# EAGLE design Arduino MEGA shield (EAGLE 7.1.0)
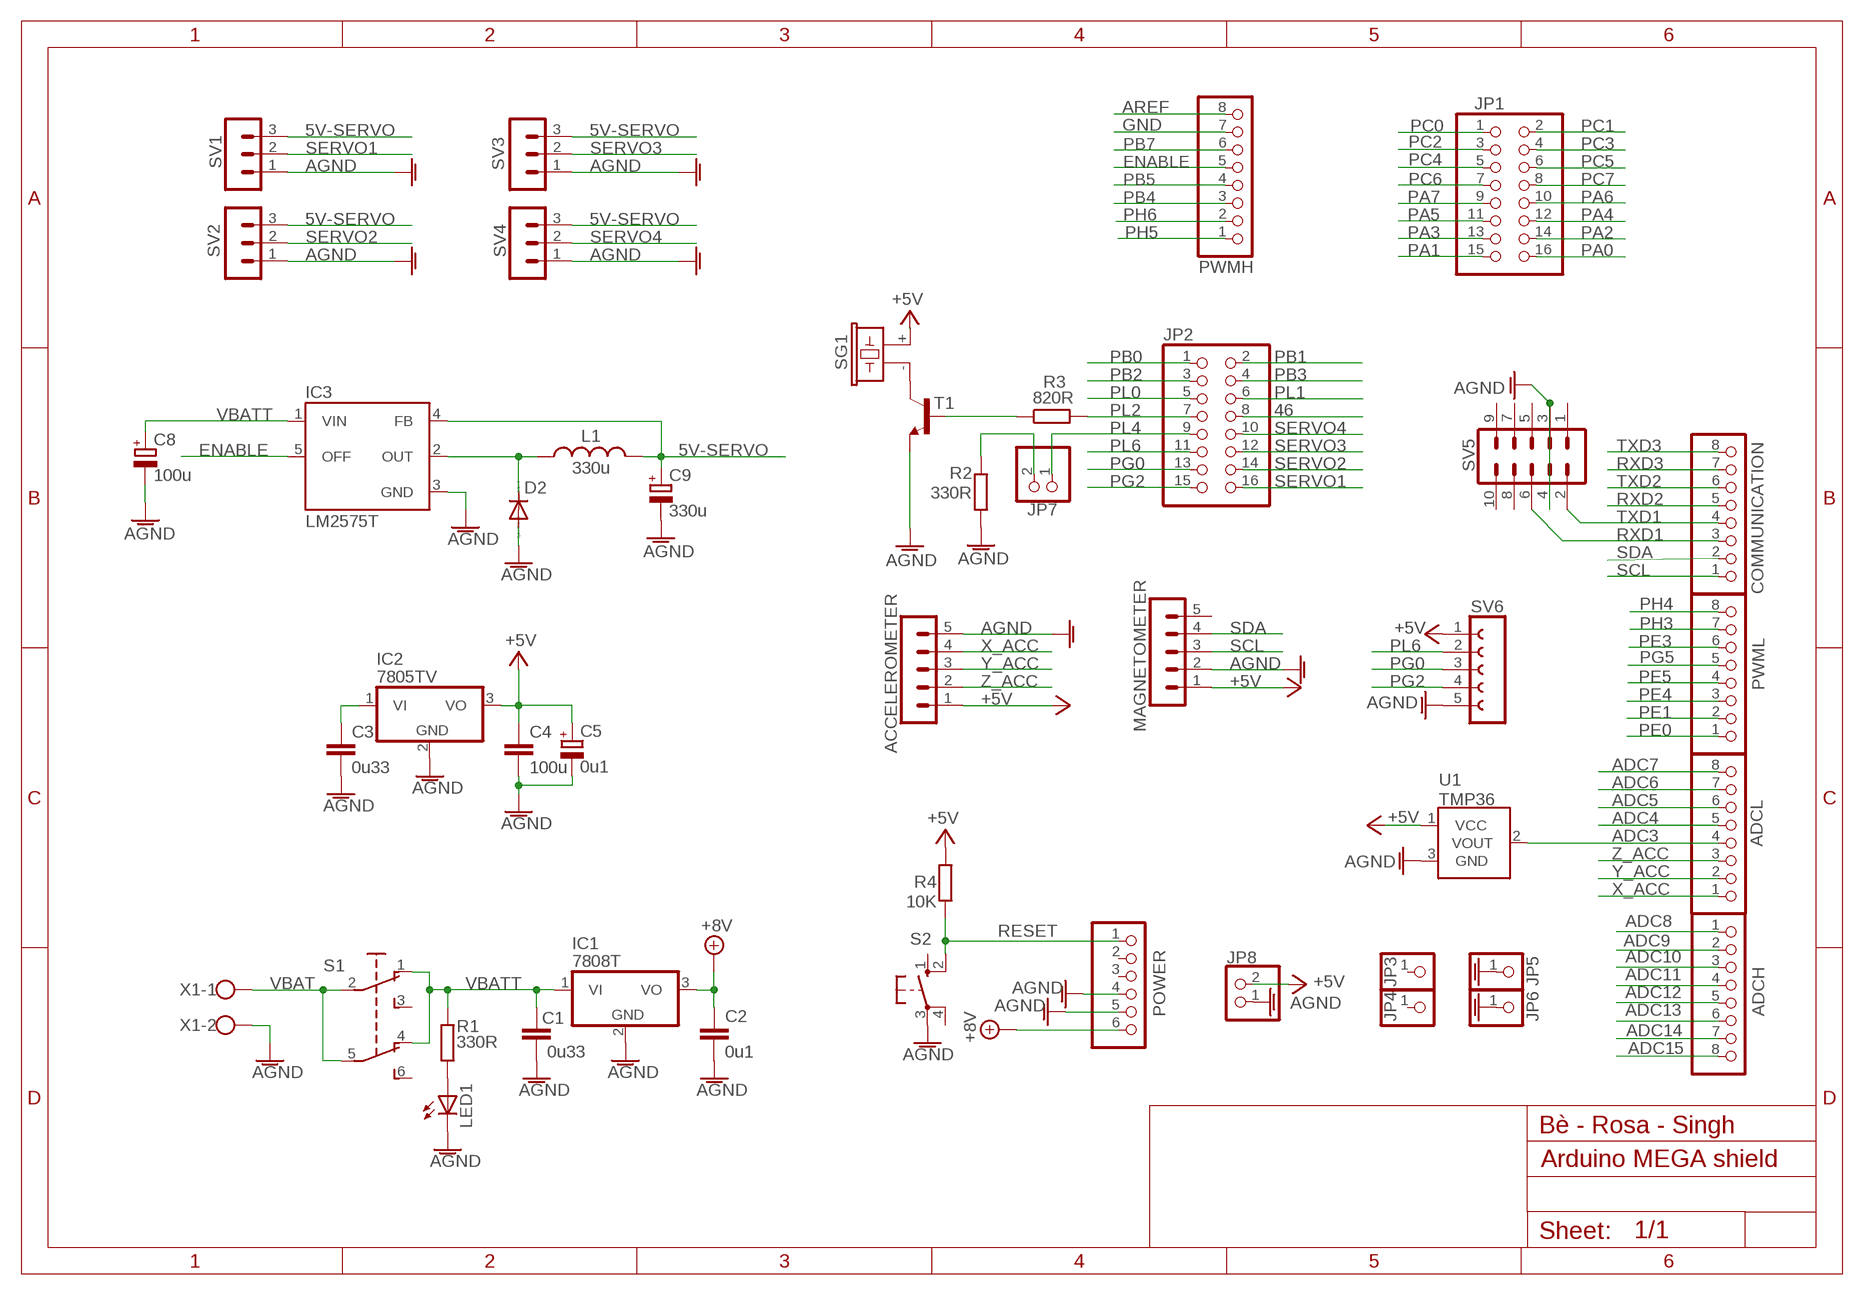
[diagram p0: schematic, sheet 1]

## Parts
ACCELEROMETER  MA05-1  [MA05-1]
ADCH  PINHD-1X8  [1X08]
ADCL  PINHD-1X8  [1X08]
C1  0u33  C-EU050-035X075  [C050-035X075]
C2  0u1  C-EU050-035X075  [C050-035X075]
C3  0u33  C-EU050-035X075  [C050-035X075]
C4  100u  C-EU050-035X075  [C050-035X075]
C5  0u1  CPOL-EUE2.5-7  [E2,5-7]
C8  100u  CPOL-EUE3.5-8  [E3,5-8]
C9  330u  CPOL-EUE3.5-8  [E3,5-8]
COMMUNICATION  PINHD-1X8  [1X08]
D2  1N5819  BA221  [DO35-10]
IC1  7808T  [TO220H]
IC2  7805TV  [TO220V]
IC3  LM2575T  [TO220-5]
JP1  PINHD-2X8  [2X08]
JP2  PINHD-2X8  [2X08]
JP3  PINHD-1X1  [1X01]
JP4  PINHD-1X1  [1X01]
JP5  PINHD-1X1  [1X01]
JP6  PINHD-1X1  [1X01]
JP7  PINHD-1X2  [1X02]
JP8  PINHD-1X2  [1X02]
L1  330u  INDUCTORAXIAL-0.6  [AXIAL-0.6]
LED1  LED5MM  [LED5MM]
MAGNETOMETER  MA05-1  [MA05-1]
POWER  PINHD-1X6  [1X06]
PWMH  PINHD-1X8  [1X08]
PWML  PINHD-1X8  [1X08]
R1  330R  R-EU_0207/10  [0207/10]
R2  330R  R-EU_0207/10  [0207/10]
R3  820R  R-EU_0207/10  [0207/10]
R4  10K  R-EU_0207/10  [0207/10]
S1  TL46PO  [TL4XPO]
S2  10-XX  [B3F-10XX]
SG1  F/CM12P  [F/CM12P]
SV1  MA03-1  [MA03-1]
SV2  MA03-1  [MA03-1]
SV3  MA03-1  [MA03-1]
SV4  MA03-1  [MA03-1]
SV5  MA05-2  [MA05-2]
SV6  FE05-1  [FE05-1]
T1  BC547A-NPN-TO92-CBE  [TO92-CBE]
U1  TMP36  TMP36GT9  [TO-92]
X1  W237-102  [W237-102]

## Nets
5V-SERVO: C9.+ IC3.4(FB) L1.P$2 SV1.3 SV2.3 SV3.3 SV4.3
46: JP2.8
+5V [usbvcc]: ACCELEROMETER.1 C4.1 C5.+ IC2.3(VO) JP8.2 MAGNETOMETER.1 R4.2 SG1.+ SV6.1 U1.1(VCC)
+8V: C2.1 IC1.3(VO) POWER.6
ADC3: ADCL.4 U1.2(VOUT)
ADC4: ADCL.5
ADC5: ADCL.6
ADC6: ADCL.7
ADC7: ADCL.8
ADC8: ADCH.1
ADC9: ADCH.2
ADC10: ADCH.3
ADC11: ADCH.4
ADC12: ADCH.5
ADC13: ADCH.6
ADC14: ADCH.7
ADC15: ADCH.8
AGND: ACCELEROMETER.5 C1.2 C2.2 C3.2 C4.2 C5.- C8.- C9.- D2.A IC1.2(GND) IC2.2(GND) IC3.3(GND) JP5.1 JP6.1 JP8.1 LED1.K(C) MAGNETOMETER.2 POWER.4 POWER.5 R2.2 S2.3(P) SV1.1 SV2.1 SV3.1 SV4.1 SV5.3 SV5.4 SV6.5 T1.E U1.3(GND) X1.2
AREF: PWMH.8
ENABLE: IC3.5(OFF) PWMH.5
GND [gnd]: PWMH.7
N$1: JP7.2 R2.1
N$2: LED1.A R1.1
N$3: C3.1 IC2.1(VI)
N$4: R3.1 T1.B
N$5: D2.C IC3.2(OUT) L1.P$1
N$6: SG1.- T1.C
PA0: JP1.16
PA1: JP1.15
PA2: JP1.14
PA3: JP1.13
PA4: JP1.12
PA5: JP1.11
PA6: JP1.10
PA7: JP1.9
PB0: JP2.1
PB1: JP2.2
PB2: JP2.3
PB3: JP2.4
PB4: PWMH.3
PB5: PWMH.4
PB7: PWMH.6
PC0: JP1.1
PC1: JP1.2
PC2: JP1.3
PC3: JP1.4
PC4: JP1.5
PC5: JP1.6
PC6: JP1.7
PC7: JP1.8
PE0: PWML.1
PE1: PWML.2
PE3: PWML.6
PE4: PWML.3
PE5: PWML.4
PG0: JP2.13 SV6.3
PG2: JP2.15 SV6.4
PG5: PWML.5
PH3: PWML.7
PH4: PWML.8
PH5: PWMH.1
PH6: PWMH.2
PL0: JP2.5
PL1: JP2.6
PL2: JP2.7 R3.2
PL4: JP2.9 JP7.1
PL6: JP2.11 SV6.2
RESET: POWER.1 R4.1 S2.2(S1)
RXD1: COMMUNICATION.3 SV5.6
RXD2: COMMUNICATION.5
RXD3: COMMUNICATION.7
SCL: COMMUNICATION.1 MAGNETOMETER.3
SDA: COMMUNICATION.2 MAGNETOMETER.4
SERVO1: JP2.16 SV1.2
SERVO2: JP2.14 SV2.2
SERVO3: JP2.12 SV3.2
SERVO4: JP2.10 SV4.2
TXD1: COMMUNICATION.4 SV5.2
TXD2: COMMUNICATION.6
TXD3: COMMUNICATION.8
VBAT: S1.2(P) S1.5(P1) X1.1
VBATT: C1.1 C8.+ IC1.1(VI) IC3.1(VIN) R1.2 S1.1(O) S1.4(O1)
X_ACC: ACCELEROMETER.4 ADCL.1
Y_ACC: ACCELEROMETER.3 ADCL.2
Z_ACC: ACCELEROMETER.2 ADCL.3
Unconnected: JP3.1 JP4.1 MAGNETOMETER.5 POWER.2 POWER.3 S1.3(S) S1.6(S1) S2.1(S) S2.4(P1) SV5.1 SV5.5 SV5.7 SV5.8 SV5.9 SV5.10

## Notes on the sheet
- Bè - Rosa - Singh

## Library data of the parts
ACCELEROMETER MAGNETOMETER = con-lstb:MA05-1: PIN HEADER; OC_FARNELL: unknown; OC_NEWARK: unknown
ADCH ADCL COMMUNICATION PWMH PWML = pinhead:PINHD-1X8: PIN HEADER
C1-C4 = rcl:C-EU: CAPACITOR, European symbol
C5 C8 C9 = rcl:CPOL-EU: POLARIZED CAPACITOR, European symbol
D2 = diode:BA221: DIODE high speed (Philips)
IC1 IC2 = linear:78*: Positive VOLTAGE REGULATOR Source: http://cache.national.com/ds/LM/LM78L05.pdf http://www.fairchildsemi.com/ds/LM/LM7805.pdf
IC3 = v-reg-3:LM2575: National Semiconductor <http://www.national.com> 1.0A "Simple Switcher"(c) 52kHz, Vout 1.23-37V (HV: 57V), Vin 40V (HV: 60V), 50µA standby current
JP1 JP2 = pinhead:PINHD-2X8: PIN HEADER
JP3-JP6 = pinhead:PINHD-1X1: PIN HEADER
JP7 JP8 = pinhead:PINHD-1X2: PIN HEADER
L1 = SparkFun-Passives:INDUCTOR: Inductors Basic Inductor/Choke - 0603 and 1206. Footprints are not proven and vary greatly between part numbers. INDUCTOR POWER 3.3UH 4.0A SMD 0.197" L x 0.197" W x 0.177" H (5.00mm x 5.00mm x 4.50mm)
LED1 = led:LED: LED OSRAM: - CHIPLED LG R971, LG N971, LY N971, LG Q971, LY Q971, LO R971, LY R971 LH N974, LH R974 LS Q976, LO Q976, LY Q976 LO Q996 - Hyper CHIPLED LW Q18S LB Q993, LB Q99A, LB R99A - SideLED LS A670, LO A670, LY A670, LG A670, LP A670 LB A673, LV A673, LT A673, LW A673 LH A674 LY A675 LS A676, LA A676, LO A676, LY A676, LW A676 LS A679, LY A679, LG A679 - Hyper Micro SIDELED® LS Y876, LA Y876, LO Y876, LY Y876 LT Y87S - SmartLED LW L88C, LW L88S LB L89C, LB L89S, LG L890 LS L89K, LO L89K, LY L89K LS L896, LA L896, LO L896, LY L896 - TOPLED LS T670, LO T670, LY T670, LG T670, LP T670 LSG T670, LSP T670, LSY T670, LOP T670, LYG T670 LG T671, LOG T671, LSG T671 LB T673, LV T673, LT T673, LW T673 LH T674 LS T676, LA T676, LO T676, LY T676, LB T676, LH T676, LSB T676, LW T676 LB T67C, LV T67C, LT T67C, LS T67K, LO T67K, LY T67K, LW E67C LS E67B, LA E67B, LO E67B, LY E67B, LB E67C, LV E67C, LT E67C LW T67C LS T679, LY T679, LG T679 LS T770, LO T770, LY T770, LG T770, LP T770 LB T773, LV T773, LT T773, LW T773 LH T774 LS E675, LA E675, LY E675, LS T675 LS T776, LA T776, LO T776, LY T776, LB T776 LHGB T686 LT T68C, LB T68C - Hyper Mini TOPLED® LB M676 - Mini TOPLED Santana® LG M470 LS M47K, LO M47K, LY M47K Source: http://www.osram.convergy.de LUXEON: - LUMILED® LXK2-PW12-R00, LXK2-PW12-S00, LXK2-PW14-U00, LXK2-PW14-V00 LXK2-PM12-R00, LXK2-PM12-S00, LXK2-PM14-U00 LXK2-PE12-Q00, LXK2-PE12-R00, LXK2-PE12-S00, LXK2-PE14-T00, LXK2-PE14-U00 LXK2-PB12-K00, LXK2-PB12-L00, LXK2-PB12-M00, LXK2-PB14-N00, LXK2-PB14-P00, LXK2-PB14-Q00 LXK2-PR12-L00, LXK2-PR12-M00, LXK2-PR14-Q00, LXK2-PR14-R00 LXK2-PD12-Q00, LXK2-PD12-R00, LXK2-PD12-S00 LXK2-PH12-R00, LXK2-PH12-S00 LXK2-PL12-P00, LXK2-PL12-Q00, LXK2-PL12-R00 Source: www.luxeon.com KINGBRIGHT: KA-3528ASYC Source: www.kingbright.com
POWER = pinhead:PINHD-1X6: PIN HEADER
R1-R4 = rcl:R-EU_: RESISTOR, European symbol
S1 = switch:TL46PO: TINY SWITCH ON - ON Source: http://www2.produktinfo.conrad.com/datenblaetter/700000-724999/705152-da-01-de-Subminiaturschalter_TL_36YO.pdf
S2 = switch-omron:10-XX: OMRON SWITCH; MPN: B3F-1000; OC_FARNELL: 176432; OC_NEWARK: 36M3542
SG1 = buzzer:F/CM12P: BUZZER Source: Buerklin; OC_FARNELL: unknown; OC_NEWARK: unknown
SV1-SV4 = con-lstb:MA03-1: PIN HEADER; OC_FARNELL: unknown; OC_NEWARK: unknown
SV5 = con-lstb:MA05-2: PIN HEADER; OC_FARNELL: unknown; OC_NEWARK: unknown
SV6 = con-lsta:FE05-1: FEMALE HEADER; OC_FARNELL: unknown; OC_NEWARK: unknown
T1 = transistor:*-NPN-: NPN Transistror BF959 corrected 2008.03.06
U1 = SparkFun-Sensors:TMP36: Precision degC temp sensor, analog out
X1 = con-wago-500:W237-102: WAGO SCREW CLAMP; MPN: 237-102; OC_FARNELL: unknown; OC_NEWARK: 70K9898

## Net classes
0 default: width 0.203 mm, drill 0.406 mm, clearance 0.203 mm
1 power: width 0.61 mm, drill 0.711 mm, clearance 0.203 mm
2 gnd: width 0.305 mm, drill 0.711 mm, clearance 0.203 mm
3 usbvcc: width 0.508 mm, drill 0.711 mm, clearance 0.203 mm

## Board
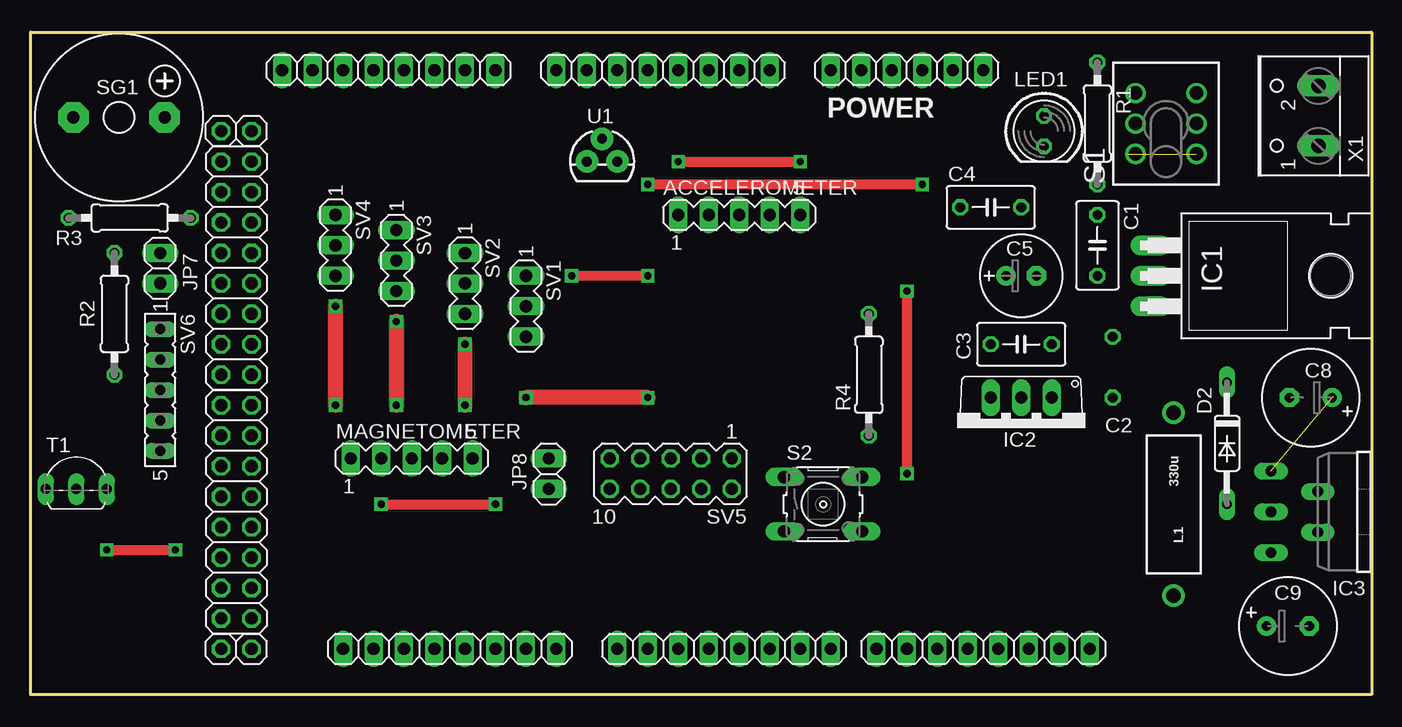
[diagram p1: board, top side]
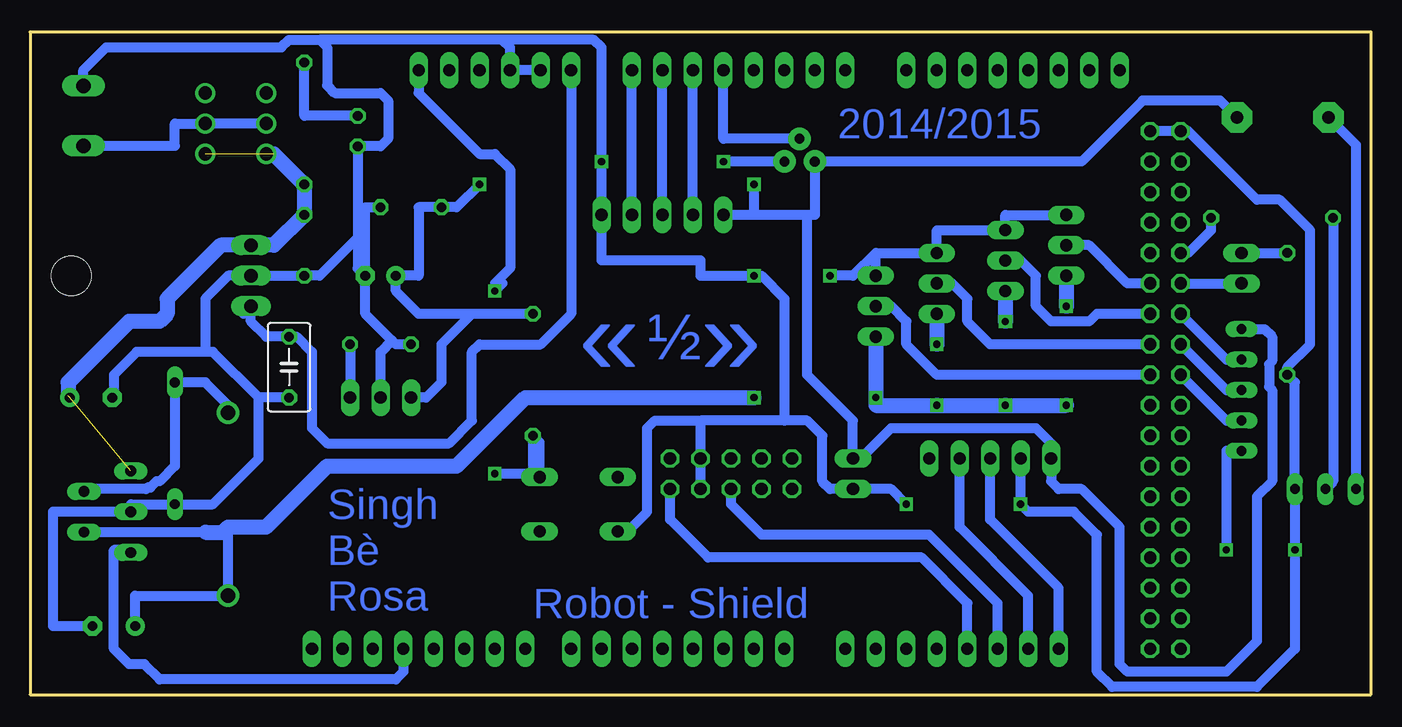
[diagram p2: board, bottom side, seen from below]

Size 111.76 x 55.25 mm. Coordinates in mm from the lower left corner, seen from the top.
Outline: 111.76,0 0,0 0,55.25 111.76,55.25 111.76,0
Copper layers (1*16): Top 0.035mm / dielectric 1.5mm / Bottom 0.035mm
Design rules "default *": minimum track width 8mil, minimum drill 16mil, track to track 8mil, track to pad 8mil, pad to pad 8mil, via to via 10mil, smd to smd 8mil, copper to edge 40mil, drill to drill 12mil, minimum pad ring 10mil, minimum via ring 10mil, stop-mask expansion 4mil, vias tented up to drill 0mil, thermal gap 10mil

### Footprints (pad centres in the part's own frame; a part is rotated, then mirrored left to right if it is on the bottom)
MA05-1 = drill 1.016 long: 1 -5.08,0; 2 -2.54,0; 3 0,0; 4 2.54,0; 5 5.08,0
1X08 = drill 1.016 long: 1 -8.89,0; 2 -6.35,0; 3 -3.81,0; 4 -1.27,0; 5 1.27,0; 6 3.81,0; 7 6.35,0; 8 8.89,0
C050-035X075 = drill 0.813 octagon: 1 -2.54,0; 2 2.54,0
E2,5-7 = drill 0.813 pad 1.6: + -1.27,0 | drill 0.813 pad 1.6 octagon: - 1.27,0
E3,5-8 = drill 0.813 pad 1.6: + -1.778,0 | drill 0.813 pad 1.6 octagon: - 1.778,0
DO35-10 = drill 0.813 long: A 5.08,0; C -5.08,0
TO220H = drill 1.118 long: 1 -2.54,-10.16; 2 0,-10.16; 3 2.54,-10.16 | hole 3.302: 0,4.826
TO220V = drill 1.016 long: 1 -2.54,-2.54; 2 0,-2.54; 3 2.54,-2.54
TO220-5 = drill 0.9 long: 1 -3.4,-8.4; 2 -1.7,-4.5; 3 0,-8.4; 4 1.7,-4.5; 5 3.4,-8.4
2X08 = drill 1.016 octagon: 1 -8.89,-1.27; 2 -8.89,1.27; 3 -6.35,-1.27; 4 -6.35,1.27; 5 -3.81,-1.27; 6 -3.81,1.27; 7 -1.27,-1.27; 8 -1.27,1.27; 9 1.27,-1.27; 10 1.27,1.27; 11 3.81,-1.27; 12 3.81,1.27; 13 6.35,-1.27; 14 6.35,1.27; 15 8.89,-1.27; 16 8.89,1.27
1X01 = drill 1.016 octagon: 1 0,0
1X02 = drill 1.016 long: 1 -1.27,0; 2 1.27,0
AXIAL-0.6 = drill 1.2 pad 1.88: P$1 -7.62,0; P$2 7.62,0
LED5MM = drill 0.813 octagon: A -1.27,0; K 1.27,0
1X06 = drill 1.016 long: 1 -6.35,0; 2 -3.81,0; 3 -1.27,0; 4 1.27,0; 5 3.81,0; 6 6.35,0
0207/10 = drill 0.813 octagon: 1 -5.08,0; 2 5.08,0
TL4XPO = drill 1.1 pad 1.676: 1 -2.54,2.54; 2 0,2.54; 3 2.54,2.54; 4 -2.54,-2.54; 5 0,-2.54; 6 2.54,-2.54
B3F-10XX = drill 1.016 long: 1 -3.251,2.261; 2 3.251,2.261; 3 -3.251,-2.261; 4 3.251,-2.261
F/CM12P = drill 1.016 pad 2.54 octagon: + 3.81,0; - -3.81,0
MA03-1 = drill 1.016 long: 1 -2.54,0; 2 0,0; 3 2.54,0
MA05-2 = drill 1.016 octagon: 1 -5.08,-1.27; 2 -5.08,1.27; 3 -2.54,-1.27; 4 -2.54,1.27; 5 0,-1.27; 6 0,1.27; 7 2.54,-1.27; 8 2.54,1.27; 9 5.08,-1.27; 10 5.08,1.27
FE05-1 = drill 0.813 long: 1 -5.08,0; 2 -2.54,0; 3 0,0; 4 2.54,0; 5 5.08,0
TO92-CBE = drill 0.813 long: B 0,0; C -2.54,0; E 2.54,0
TO-92 = drill 0.813 pad 1.88: 1 -1.27,0; 2 0,1.905; 3 1.27,0
W237-102 = drill 1.194 long: 1 -2.5,-1.27; 2 2.5,-1.27

### Placement (x,y rotation side)
ACCELEROMETER  59.05,40 0 top
ADCH  29.85,52.07 180 top
ADCL  52.71,52.07 180 top
C1  88.9,37.47 270 top
C2  90.17,27.3 270 bottom
C3  82.55,29.21 180 top
C4  80.01,40.64 0 top
C5  82.55,34.92 0 top
C8  106.68,24.77 180 top
C9  104.78,5.72 0 top
COMMUNICATION  34.93,3.81 0 top
D2  99.69,20.95 270 top
IC1  103.5,34.92 270 top
IC2  82.55,22.23 180 top
IC3  111.76,15.24 270 top
JP1  17.15,15.24 270 top
JP2  17.15,35.56 270 top
JP3  18.42,3.81 180 top
JP4  15.88,3.81 180 top
JP5  18.42,46.99 180 top
JP6  15.88,46.99 180 top
JP7  10.8,35.56 90 top
JP8  43.18,18.41 90 top
L1  95.25,15.88 270 top
LED1  84.45,46.99 270 top
MAGNETOMETER  31.75,19.69 0 top
POWER  73.03,52.07 180 top
PWMH  79.38,3.81 0 top
PWML  57.79,3.81 0 top
R1  88.9,47.62 270 top
R2  6.98,31.75 270 top
R3  8.26,39.75 0 top
R4  69.85,26.67 90 top
S1  94.62,47.62 90 top
S2  66.04,15.88 0 top
SG1  7.37,48.13 0 top
SV1  41.28,32.39 270 top
SV2  36.2,34.29 270 top
SV3  30.48,36.19 270 top
SV4  25.4,37.47 270 top
SV5  53.34,18.41 180 top
SV6  10.8,25.4 270 top
T1  3.81,17.15 0 top
U1  47.62,44.45 0 top
X1  106.05,48.26 90 top

### Tracks (layer width: path | path; a pad name or v marks a point on that pad's centre or on a via)
5V-SERVO  (via drill 0.6)
  Top 1.27: v25.4,32.39 v25.4,24.13 | v30.48,31.12 v30.48,24.13 | v36.2,29.21 v36.2,24.13 | v51.44,24.77 v41.28,24.77
  Bottom 0.813: 97.16,13.54 IC3.4 | C9.+ 103,8.26 L1.P$2 95.25,13.97
  Bottom 1.27: SV1.3 v41.28,24.77 41.28,24.13 v36.2,24.13 v30.48,24.13 v25.4,24.13 | SV4.3 v25.4,32.39 | SV3.3 v30.48,31.12 | SV2.3 v36.2,29.21 | 97.16,13.54 95.68,13.54 95.25,13.97 92.08,13.97 87,19.05 76.2,19.05 70.48,24.77 v51.44,24.77
+5V  (via drill 0.6)
  Top 0.813: v74.3,42.55 v51.44,42.55
  Bottom 0.813: v74.3,42.55 76.2,40.64 C4.1 79.38,40.64 79.38,34.92 C5.+ 81.28,33.66 79.38,31.75 R4.2 74.93,31.75 77.47,29.21 77.47,26.03 78.74,24.77 79.38,24.77 80.01,25.4 IC2.3 | 46.99,40 46.36,40 U1.1 24.13,44.45 19.05,49.53 12.57,49.53 SG1.+ | 46.99,40 51.44,40 | 51.44,40 ACCELEROMETER.1 | v51.44,42.55 51.44,40 | 46.99,40 46.99,26.67 43.18,22.86 JP8.2 42.55,19.69 40.01,22.23 27.94,22.23 26.67,20.95 MAGNETOMETER.1 26.67,17.78 26.04,17.15 24.13,17.15 20.96,13.97 20.96,2.54 20.32,1.91 12.07,1.91 9.53,4.45 9.53,16.51 8.26,17.78 8.26,25.4 8.51,25.65 8.51,27.56 8.26,27.81 8.26,29.84 8.89,30.48 SV6.1
+8V
  Bottom 0.813: POWER.6 66.67,31.75 69.22,29.21 74.3,29.21 74.93,28.58 74.93,22.86 76.84,20.95 87,20.95 88.27,22.23 88.27,28.58 89.53,29.84 C2.1 92.08,29.84 93.34,31.12 IC1.3 93.98,31.75
ADC3
  Bottom 0.813: U1.2 53.98,46.36 ADCL.4
AGND  (via drill 0.6)
  Top 0.813: v53.98,44.45 v64.14,44.45 | v45.09,34.92 v51.44,34.92 | v29.21,15.88 v38.73,15.88 | v6.35,12.06 v12.07,12.06
  Bottom 0.813: 84.45,38.1 LED1.K 82.55,45.72 81.92,46.36 81.92,49.53 82.55,50.17 86.36,50.17 87,50.8 87,53.97 87.63,54.61 | 84.45,38.1 87.63,34.92 C1.2 IC1.2 95.25,34.92 97.16,33.02 97.16,28.58 | C9.- 109.86,5.72 109.86,15.24 IC3.3 103.36,15.88 D2.A 96.52,15.88 92.71,19.69 92.71,24.77 | C5.- 83.82,31.75 81.6,29.53 | 84.45,38.1 84.45,35.56 C5.- | C5.- 83.82,40.64 C4.2 | X1.2 107.31,52.07 105.41,53.97 90.81,53.97 90.17,54.61 87.63,54.61 | 97.16,28.58 96.52,28.58 92.71,24.77 | 97.16,28.58 102.87,28.58 104.78,26.67 104.78,24.89 C8.- | POWER.5 POWER.4 71.75,53.97 72.39,54.61 | 72.39,54.61 87.63,54.61 | 72.39,54.61 64.77,54.61 64.14,53.97 v64.14,44.45 ACCELEROMETER.5 64.14,36.19 55.88,36.19 55.88,34.92 v51.44,34.92 50.8,34.92 48.9,33.02 48.9,22.86 | U1.3 v53.98,44.45 | SV1.1 41.28,36.83 | 41.28,36.83 SV2.1 36.2,38.73 SV3.1 30.48,40 SV4.1 | SV5.4 SV5.3 55.88,22.86 | 48.9,22.86 46.99,22.86 45.72,21.59 45.72,17.78 45.09,17.15 JP8.1 40.01,17.15 v38.73,15.88 | 48.9,22.86 55.88,22.86 | MAGNETOMETER.2 v29.21,15.88 28.58,15.24 24.77,15.24 22.86,13.34 22.86,1.91 21.59,0.63 9.53,0.63 6.35,3.81 v6.35,12.06 T1.E 6.35,26.03 R2.2 6.98,27.3 5.08,29.21 5.08,38.73 7.62,41.28 9.53,41.28 15.24,46.99 JP6.1 JP5.1 | 41.28,36.83 43.18,34.92 v45.09,34.92 | SV6.5 12.07,20.32 v12.07,12.06 | S2.3 61.95,13.61 60.33,15.24 60.33,22.23 59.69,22.86 55.88,22.86 | C3.2 81.28,29.21 81.6,29.53 | IC2.2 82.55,28.58 81.6,29.53 | C2.2 92.71,24.77
ENABLE
  Bottom 0.813: IC3.5 103.36,12.06 104.78,12.06 104.78,3.81 103.5,2.54 102.23,2.54 100.97,1.27 81.28,1.27 80.65,1.91 PWMH.5
N$1
  Bottom 0.813: JP7.2 R2.1
N$2
  Bottom 0.813: LED1.A 88.9,48.26 R1.1
N$3
  Bottom 0.813: C3.1 IC2.1
N$4
  Bottom 0.813: R3.1 3.18,17.78 T1.B
N$5
  Bottom 0.813: IC3.2 107.06,17.15 102.11,17.15 101.98,17.27 101.73,17.27 101.22,17.78 100.97,17.78 99.69,19.05 D2.C 97.16,26.03 95.25,24.13 L1.P$1
N$6
  Bottom 0.813: SG1.- 1.27,45.85 T1.C
N$7  (via drill 0.6)
  other vias: 51.44,42.55
N$8  (via drill 0.6)
  other vias: 25.4,32.39
N$9  (via drill 0.6)
  other vias: 30.48,31.12
N$10  (via drill 0.6)
  other vias: 36.2,29.21
PG0
  Bottom 0.813: SV6.3 12.07,25.4 JP2.13
PG2
  Bottom 0.813: SV6.4 12.07,22.86 JP2.15
PL2
  Bottom 0.813: JP2.7 15.24,36.83 13.34,38.73 R3.2
PL4
  Bottom 0.813: JP2.9 JP7.1
PL6
  Bottom 0.813: SV6.2 12.07,27.94 JP2.11
RESET  (via drill 0.6)
  Top 0.813: v73.03,33.66 v73.03,18.41
  Bottom 0.813: S2.2 69.29,21.03 R4.1 69.85,19.05 69.22,18.41 v73.03,18.41 | POWER.1 79.38,50.17 74.3,45.08 73.03,45.08 71.75,43.81 71.75,35.56 73.03,34.29 72.39,34.29 v73.03,33.66
RXD1
  Bottom 0.813: COMMUNICATION.3 31.12,7.62 36.83,13.34 50.8,13.34 53.34,15.88 SV5.6
SCL
  Bottom 0.813: COMMUNICATION.1 26.04,8.89 31.75,14.6 MAGNETOMETER.3
SDA
  Bottom 0.813: COMMUNICATION.2 28.58,8.26 34.29,13.97 MAGNETOMETER.4
SERVO1
  Bottom 0.813: JP2.16 36.2,26.67 38.73,29.21 38.73,31.12 40.01,32.39 SV1.2
SERVO2
  Bottom 0.813: JP2.14 31.75,29.21 33.66,31.12 33.66,33.02 34.93,34.29 SV2.2
SERVO3
  Bottom 0.813: JP2.12 22.86,31.75 23.5,31.12 26.67,31.12 27.94,32.39 27.94,34.92 29.21,36.19 SV3.2
SERVO4
  Bottom 0.813: JP2.10 20.32,34.29 23.5,37.47 SV4.2
TXD1
  Bottom 0.813: COMMUNICATION.4 33.66,7.62 37.47,11.43 55.25,11.43 58.42,14.6 SV5.2
VBAT
  Bottom 0.813: S1.2 S1.5 99.69,47.62 99.69,45.76 X1.1
VBATT  (4 unrouted)
  Bottom 1.27: 91.44,45.08 R1.2 C1.1 91.44,37.47 IC1.1 95.89,37.47 100.33,33.02 100.33,31.75 100.97,31.12 103.5,31.12 108.59,26.03 108.59,24.89
X_ACC
  Bottom 0.813: ACCELEROMETER.4 ADCL.1
Y_ACC
  Bottom 0.813: ACCELEROMETER.3 ADCL.2
Z_ACC
  Bottom 0.813: ACCELEROMETER.2 ADCL.3

### Text on the board
Bottom: 2014/2015 | ½ | » | « | Singh / Bè / Rosa | Robot - Shield